# Altium schematic sheet Main.SchDoc: Power entry for ESP32 Web Radio
size A4; Engineer: CT; SheetNumber: 1; SheetTotal: 1; SPICEModelCacheKCJALLRK: <root> / <DocumentId>KCJALLRK</DocumentId> / <CacheFrame Number="0"> / <Model Name="4030_78438357100_10u" Kind="CKT"> / <Text>******* / .subckt 4030_78438357100_10u 1 2 / Rp 1 2 13721 / Cp 1 2 11.841p / Rs 1 N3 0.1008 / L1 N3 2 9.47u / .ends 4030_78438357100_10u</Text> / </Model> / </CacheFrame> / </root>
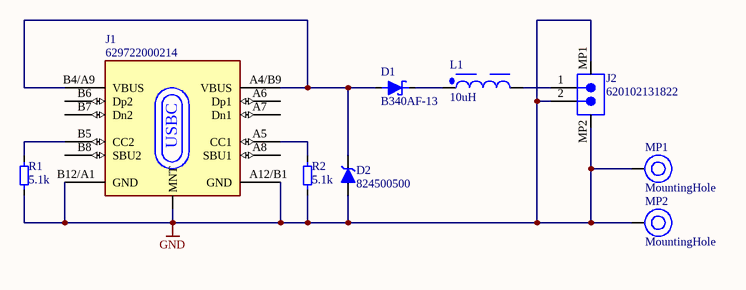
[diagram p0: Main.SchDoc]

## Parts
D1  B340AF-13  [DO-214AC_UNI]
D2  824500500  [DO-214AC_UNI]
J1  629722000214  [629722000214]
J2  620102131822  [620102131822]
L1  Inductance: 10uH  [WE-MAIA_4030]  (hidden comment: 78438357100)
MP1  MountingHole  [PTH-M2D4.1X4.1]  (no BOM)
MP2  MountingHole  [PTH-M2D4.1X4.1]  (no BOM)
R1  value 5.1k  [0603-R-N]  (hidden comment: Resistor 5.1k +/-1% 50V 0603)
R2  value 5.1k  [0603-R-N]  (hidden comment: Resistor 5.1k +/-1% 50V 0603)

## Nets
GND: D2.2(A) J1.A12/B1(GND) J1.B12/A1(GND) J1.MNT J2.2 J2.MP1 J2.MP2 MP1.1(H1) MP2.1(H1) R1.2 R2.2
NetD1_1: D1.1(K) L1.1
NetD1_2: D1.2(A) D2.1(K) J1.A4/B9(VBUS) J1.B4/A9(VBUS)
NetJ1_A5: J1.A5(CC1) R2.1
NetJ1_B5: J1.B5(CC2) R1.1
NetJ2_1: J2.1 L1.2

Not connected (* = marked no-connect by the designer): J1 A6(Dp1) A7(Dn1) A8(SBU1) B6(Dp2) B7(Dn2) B8(SBU2)

## Notes on the sheet
- Title
- Sheet Revision:
- Link:
- Size:
- Project:
- Engineer:
- A4
- Date:
- Sheet
- of
- File:
- (in symbol CMP-088-000027-8) USBC

## Library data of the parts
D1 = CMP-004-00050-4: Diode 40 V 3A Surface Mount SMAF; Max Reverse Voltage (DC): 40V; Forward Voltage: 500 mV @ 3 A; Series: -; Mounting Technology: Surface Mount; Case/Package: SMA; JLCPCB Part #: C5310924; Packaging: Cut Tape; Forward Current: 3A; RoHS Compliant: Yes
D2 = CMP-074-000038-8: WE-TVSP SMT Power TVS Diode, DO-214AC, 400W, 5VDC, Unidirectional; Manufacturer: Wurth Elektronik; Clamping Voltage: 9.2V; (Reverse) Peak Pulse Current: 43.5A; (Reverse) Breakdown Voltage: 6.7V; DC Operating Voltage: 5V; Pin Count: 2; Component Type: Standard; Published Date: July 2020; Source: WE-TVSP_DO-214AC_Unidirectional.SchLib; JLCPCB Part #: C2925443; Mounting Technology: SMT; ComponentLink1URL: http://www.we-online.de; Polarity: Unidirectional; Power Dissipation: 400W; ComponentLink2URL: https://www.we-online.com/catalog/datasheet/824500500.pdf; Design Item ID: 824500500; ComponentLink2Description: Datasheet; Operating Temperature: -65 to +150degC; Packaging: Tape and Reel; Manufacturer Part Number: 824500500; Size: DO-214AC; ComponentLink1Description: Manufacturer
J1 = CMP-088-000027-8: WR-USB 2.0 Type C, Receptacle, Horizontal, SMT; pin to pad: MNT>S1+S2+S3+S4; Manufacturer: Wurth Elektronik; Working Voltage: 20VAC; Number of Ports: 1; Rated Current: 5A; Interface Type: Type C; Application: USB 2.0; Component Type: Standard; JLCPCB Part #: C2982555; ComponentLink1URL: https://www.we-online.com/redexpert/article/629722000214?ad; Manufacturer Part Number: 629722000214; Source: WR-USB.SchLib; Design Item ID: 629722000214; ComponentLink1Description: Website Link; Orientation: Horizontal; Pin Count: 13; Match Code: WR-USB; Operating Temperature Min: -40°C; Mount: Surface Mount; ComponentLink2Description: Datasheet Link; ComponentLink2URL: https://www.we-online.com/redexpert/spec/629722000214?ad; Number of Pins: 16; Category: Input/Output Connectors; Gender: Receptacle; Packaging: Tape and Reel; Operating Temperature Max: 85°C
J2 = CMP-047-000040-11: WR-WTB SMT Male Horizontal Shrouded Header, pitch 2mm, 2p; Pin Number: 2; Working Voltage: 100VAC; Withstanding Voltage: 800VAC; Rated Current: 2A; Contact Resistance: 20mOhm; Pitch: 2mm; Operating Temperature: -25 to +85degC; ComponentLink1Description: Manufacturer; ComponentLink1URL: http://www.we-online.de; Gender: Male; Packaging: Tape and Reel; Pin Count: 2; Component Type: Standard; Mounting Technology: SMT; Type: Horizontal; Part Number: 620102131822; ComponentLink2Description: Datasheet; Publisher: Wurth Elektronik; Source: WR-WTB_2.00mm.SchLib; Design Item ID: 620102131822; Published Date: January 2020; JLCPCB Part #: C295747; ComponentLink2URL: https://www.we-online.com/catalog/datasheet/620102131822.pdf
L1 = CMP-116-000112-3: WE-MAIA SMT Power Inductor, size 4030, 10uH, 3.05A, 110mOhm; Manufacturer: Wurth Elektronik; Self Resonant Frequency: 15MHz; Saturation Current @ 10%: 3A; Case/Size Code: 4030; Saturation Current @ 30%: 5.95A; Design Item ID: 78438357100; Packaging: Tape and Reel; Rated Current: 3.05A; Height: 3.1mm; DC Resistance Max: 110mOhm; Automotive: Yes; ComponentLink1Description: Website Link; Length: 4.1mm; Source: WE-MAIA.SchLib; Component Type: Standard; ComponentLink2URL: https://www.we-online.com/redexpert/spec/78438357100?ad; Category: Power Inductors; Operating Temperature Max: 125°C; Width: 4.1mm; ComponentLink2Description: Datasheet Link; Mount: Surface Mount; Manufacturer Part Number: 78438357100; ComponentLink1URL: https://www.we-online.com/redexpert/article/78438357100?ad; Match Code: WE-MAIA; Pin Count: 2; Operating Temperature Min: -40°C; JLCPCB Part #: C167879
MP1 MP2 = CMP-00028-00004-12: Mounting hole.  Add this so that mounting holes placed in your design don't automagically disappear when you import changes from the schematic.; Pins: 1
R1 R2 = CMP-009-00192-17: Chip Resistor, Thick Film, General Purpose, 0603, 100mW, 50V, 5.1 kOhm, +/-1%; Tolerance: 1%; Temperature Coefficient: 100ppm/°C; Elements: 1; Voltage Rating: 50V; REACH SVHC: No SVHC; Min Operating Temperature: -55°C; Pins: 2; Resistor Type: Thick Film; Mounting Technology: SMT; Usage: General Purpose; Power Rating: 100mW; Case/Package: 0603; Max Operating Temperature: 155°C; JLCPCB Part #: C144594